# Altium schematic sheet Sheet1.SchDoc
size A4
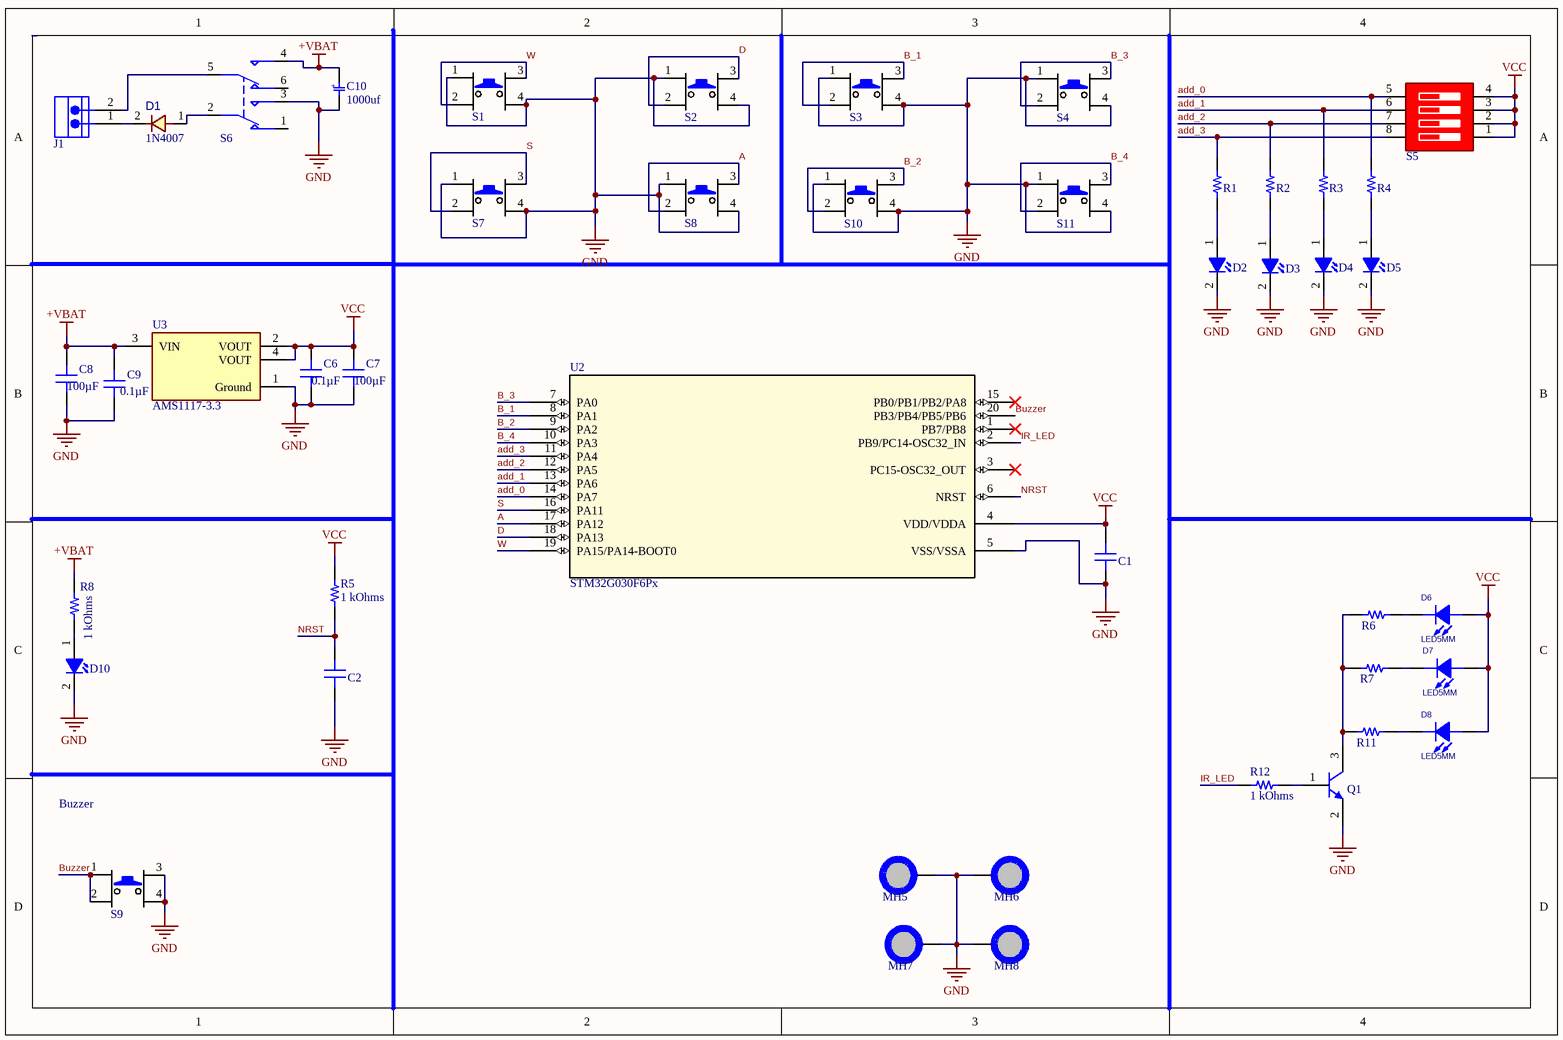
[diagram p0: Sheet1.SchDoc]

## Parts
C1  0.1µF  [CAP 0805_2012]  (value not drawn)
C2  0.1µF  [CAP 0805_2012]  (value not drawn)
C6  0.1µF  [CAP 0805_2012]
C7  100µF  [CAP 0805_2012]
C8  100µF  [CAP 0805_2012]
C9  0.1µF  [CAP 0805_2012]
C10  value 1000uf  [Cap_3_(3.5mm)]  (hidden comment: Capacitor Electrical THD)
D1  value 1N4007  [D_SMA]  (hidden comment: 1N4007 SMD M7)
D2  LED THD 3mm  [LED THD 3mm (White)]  (value not drawn)
D3  LED THD 3mm  [LED THD 3mm (White)]  (value not drawn)
D4  LED THD 3mm  [LED THD 3mm (White)]  (value not drawn)
D5  LED THD 3mm  [LED THD 3mm (White)]  (value not drawn)
D6  LED5MM  [LED THD 5mm (Yellow)]
D7  LED5MM  [LED THD 5mm (Yellow)]
D8  LED5MM  [LED THD 5mm (Yellow)]
D10  LED THD 3mm  [LED THD 3mm (White)]  (value not drawn)
J1  Socket Blue 2  [Socket Blue 2]  (value not drawn)
MH5  MH_7.4mmC_3.2mmD  [MH_7.4mmC_3.2mmD]  (value not drawn)  (no BOM)
MH6  MH_7.4mmC_3.2mmD  [MH_7.4mmC_3.2mmD]  (value not drawn)  (no BOM)
MH7  MH_7.4mmC_3.2mmD  [MH_7.4mmC_3.2mmD]  (value not drawn)  (no BOM)
MH8  MH_7.4mmC_3.2mmD  [MH_7.4mmC_3.2mmD]  (value not drawn)  (no BOM)
Q1  MMBT2222A-7-F  [DIODES SOT-23-3]  (value not drawn)
R1  50 mOhms  [RES 0805_2012]  (value not drawn)
R2  50 mOhms  [RES 0805_2012]  (value not drawn)
R3  50 mOhms  [RES 0805_2012]  (value not drawn)
R4  50 mOhms  [RES 0805_2012]  (value not drawn)
R5  1 kOhms  [RES 0805_2012]
R6  68 Ohms  [RES 0805_2012]  (value not drawn)
R7  68 Ohms  [RES 0805_2012]  (value not drawn)
R8  1 kOhms  [RES 0805_2012]
R11  68 Ohms  [RES 0805_2012]  (value not drawn)
R12  1 kOhms  [RES 0805_2012]
S1  SW_PB4 THD  [SW THD 4 PIN (25) 12X12SKHC]  (value not drawn)
S2  SW_PB4 THD  [SW THD 4 PIN (25) 12X12SKHC]  (value not drawn)
S3  SW_PB4 THD  [SW THD 4 PIN (25) 12X12SKHC]  (value not drawn)
S4  SW_PB4 THD  [SW THD 4 PIN (25) 12X12SKHC]  (value not drawn)
S5  DIP Switch 4  [dip switch 4  Blue THD]  (value not drawn)
S6  Double Switch  [SWPUST_DPDT_S2]  (value not drawn)
S7  SW_PB4 THD  [SW THD 4 PIN (25) 12X12SKHC]  (value not drawn)
S8  SW_PB4 THD  [SW THD 4 PIN (25) 12X12SKHC]  (value not drawn)
S9  SW_PB4 THD  [SW THD 4 PIN (6)]  (value not drawn)
S10  SW_PB4 THD  [SW THD 4 PIN (25) 12X12SKHC]  (value not drawn)
S11  SW_PB4 THD  [SW THD 4 PIN (25) 12X12SKHC]  (value not drawn)
U2  STM32G030F6Px  [TSSOP20]
U3  AMS1117-3.3  [SOT223-4N]

## Nets
+VBAT: C8.2 C9.2 C10.1 R8.2 S6.4 U3.3(VIN)
GND: C1.1 C2.1 C6.1 C7.1 C8.1 C9.1 C10.2 D2.2(CATHODE) D3.2(CATHODE) D4.2(CATHODE) D5.2(CATHODE) D10.2(CATHODE) MH5.0 MH6.0 MH7.0 MH8.0 Q1.2(E) S1.1 S1.4 S2.1 S2.4 S3.1 S3.4 S4.1 S4.4 S6.3 S7.1 S7.4 S8.1 S8.4 S9.3 S9.4 S10.1 S10.4 S11.1 S11.4 U2.5(VSS/VSSA) U3.1(Ground)
VCC: C1.2 C6.2 C7.2 D6.1(ANODE) D7.1(ANODE) D8.1(ANODE) R5.1 S5.1 S5.2 S5.3 S5.4 U2.4(VDD/VDDA) U3.2(VOUT) U3.4(VOUT)
A: S8.2 S8.3 U2.17(PA12)
add_0: R4.2 S5.5 U2.14(PA7)
add_1: R3.2 S5.6 U2.13(PA6)
add_2: R2.2 S5.7 U2.12(PA5)
add_3: R1.2 S5.8 U2.11(PA4)
B_1: S3.2 S3.3 U2.8(PA1)
B_2: S10.2 S10.3 U2.9(PA2)
B_3: S4.2 S4.3 U2.7(PA0)
B_4: S11.2 S11.3 U2.10(PA3)
Buzzer: S9.1 S9.2 U2.20(PB3/PB4/PB5/PB6)
D: S2.2 S2.3 U2.18(PA13)
IR_LED: R12.1 U2.2(PB9/PC14-OSC32_IN)
NRST: C2.2 R5.2 U2.6(NRST)
S: S7.2 S7.3 U2.16(PA11)
W: S1.2 S1.3 U2.19(PA15/PA14-BOOT0)
NetD1_1: D1.1 S6.2
NetD1_2: D1.2 J1.1
NetD2_1: D2.1(ANODE) R1.1
NetD3_1: D3.1(ANODE) R2.1
NetD4_1: D4.1(ANODE) R3.1
NetD5_1: D5.1(ANODE) R4.1
NetD6_2: D6.2(CATHODE) R6.2
NetD7_2: D7.2(CATHODE) R7.2
NetD8_2: D8.2(CATHODE) R11.2
NetD10_1: D10.1(ANODE) R8.1
NetJ1_2: J1.2 S6.5
NetQ1_1: Q1.1(B) R12.2
NetQ1_3: Q1.3(C) R6.1 R7.1 R11.1

Not connected (* = marked no-connect by the designer): S6 1 6; U2 1(PB7/PB8)* 3(PC15-OSC32_OUT)* 15(PB0/PB1/PB2/PA8)*

## Notes on the sheet
- Buzzer
- (in symbol Capacitor Electrical THD) +

## Library data of the parts
C1 C2 C6 C9 = AC0805KKX8R9BB104: CAP CER 0805 10% X8R 50V 100NF; Manufacturer: Yageo; Part Number: AC0805KKX8R9BB104; Applications: Automotive; Capacitance: 0.1µF; ComponentLink1Description: Datasheet; ComponentLink1URL: http://www.yageo.com/documents/recent/AC0805KKX8R9BB104.pdf; ComponentLink2Description: DigiKey Link; ComponentLink2URL: http://digikey.com/product-detail/en/yageo/AC0805KKX8R9BB104/311-4624-1-ND/9699550; Device Package: 0805 (2012 Metric); LastUpdated: 2020-09-02 01:04:19.917000; Lifecycle Status: Active; Minimum Order: 1; Mounting Type: Surface Mount, MLCC; Operating Temperature: -55°C ~ 150°C; Package / Case: 0805 (2012 Metric); Packaging: TapeAndReel; PartId: 14076; Part Status: Active; Price: 0.06; Ratings: AEC-Q200; Series: AC; Size / Dimension: 0.079 L x 0.049 W (2.00mm x 1.25mm); Supplier 1: DigiKey; Supplier Part Number 1: 311-4624-1-ND; Temperature Coefficient: X8R; Thickness (Max): 0.057 (1.45mm); Tolerance: ±10%; Value: 0.1µF; Voltage - Rated: 50V
C7 C8 = GRM21BR60J107ME15L: CAP CER 100UF 6.3V X5R 0805; Manufacturer: Murata Electronics; Tolerance: ±20%; Part Number: GRM21BR60J107ME15L; Applications: General Purpose; Capacitance: 100µF; ComponentLink1Description: Datasheet; ComponentLink1URL: https://search.murata.co.jp/Ceramy/image/img/A01X/G101/ENG/GRM21BR60J107ME15-01.pdf; ComponentLink2Description: DigiKey Link; ComponentLink2URL: http://digikey.com/product-detail/en/murata-electronics/GRM21BR60J107ME15L/490-13981-1-ND/6155811; Device Package: 0805 (2012 Metric); LastUpdated: 2020-09-02 01:04:10.617000; Lifecycle Status: Active; Minimum Order: 1; Mounting Type: Surface Mount, MLCC; Operating Temperature: -55°C ~ 85°C; Package / Case: 0805 (2012 Metric); Packaging: TapeAndReel; PartId: 16995; Part Status: Active; Price: 0.61; Series: GRM; Size / Dimension: 0.079 L x 0.049 W (2.00mm x 1.25mm); Supplier 1: DigiKey; Supplier Part Number 1: 490-13981-1-ND; Temperature Coefficient: X5R; Thickness (Max): 0.057 (1.45mm); Value: 100µF; Voltage - Rated: 6.3V
D1 = 1N4007 SMD M7: DIODE, GENERAL PURPOSE, 1000V/1A; DatasheetVersion: 2021; ComponentLink1Description: Website Smart World; ComponentLink1URL: https://www.smartw.ir/; ComponentLink2Description: Telegram; ComponentLink2URL: https://t.me/altium_smartw; ComponentLink3Description: Instagram; ComponentLink3URL: https://Instagram.com/smartgw.ir
D6-D8 = LED5MM: LED LIGHTING; Designer: Abbas Basereh; Data: 16-12-2016; Link: *; Part.No: *
MH5-MH8 = MH_7.4mmC_3.2mmD: MH_7.4MM Diameter,3.2mm Drill
Q1 = MMBT2222A-7-F: TRANS NPN 40V 0.6A SMD SOT23-3; Manufacturer: Diodes Incorporated; Current - Collector Cutoff (Max): 10nA (ICBO); Current - Collector (Ic) (Max): 600mA; DC Current Gain (hFE) (Min) @ Ic, Vce: 100 @ 150mA, 10V; Frequency - Transition: 300MHz; Power - Max: 310mW; Vce Saturation (Max) @ Ib, Ic: 1V @ 50mA, 500mA; Part Number: MMBT2222A-7-F; ComponentLink1Description: Datasheet; ComponentLink1URL: https://www.diodes.com/assets/Datasheets/ds30041.pdf; ComponentLink2Description: DigiKey Link; ComponentLink2URL: http://digikey.com/product-detail/en/diodes-incorporated/MMBT2222A-7-F/MMBT2222A-FDICT-ND/815723; LastUpdated: 2020-09-02 01:30:06.317000; Lifecycle Status: Active; Minimum Order: 1; Mounting Type: Surface Mount; Operating Temperature: -55°C ~ 150°C (TJ); Package / Case: TO-236-3, SC-59, SOT-23-3; Packaging: TapeAndReel; PartId: 84; Part Status: Active; Price: 0.02; Series: Automotive, AEC-Q101; Supplier 1: DigiKey; Supplier Part Number 1: MMBT2222A-FDICT-ND; Supplier Device Package: SOT-23-3; Transistor Type: NPN; Voltage - Collector Emitter Breakdown (Max): 40V
R1-R4 = CRM0805-FW-R050ELF: RES 0.05 OHM 1% 1/4W 0805; Manufacturer: Bourns Inc.; Power (Watts): 0.25W, 1/4W; Temperature Coefficient: ±200ppm/°C; Part Number: CRM0805-FW-R050ELF; ComponentLink1Description: Datasheet; ComponentLink1URL: https://www.bourns.com/docs/Product-Datasheets/CRM0805_1206_2010.pdf; ComponentLink2Description: DigiKey Link; ComponentLink2URL: http://digikey.com/product-detail/en/bourns-inc/CRM0805-FW-R050ELF/CRM0805-FW-R050ELFCT-ND/3592903; Composition: Thick Film; Device Package: 0805 (2012 Metric); Features: Current Sense; Height - Seated (Max): 0.024 (0.60mm); LastUpdated: 2020-09-02 01:15:22.390000; Lifecycle Status: Active; Minimum Order: 1; Number of Terminations: 2; Operating Temperature: -55°C ~ 155°C; Package / Case: 0805 (2012 Metric); Packaging: TapeAndReel; PartId: 28469; Part Status: Active; Price: 0.14; Resistance: 50 mOhms; Series: CRM0805; Size / Dimension: 0.079 L x 0.047 W (2.00mm x 1.20mm); Supplier 1: DigiKey; Supplier Part Number 1: CRM0805-FW-R050ELFCT-ND; Supplier Device Package: 0805; Tolerance: ±1%; Value: 50 mOhms
R5 R8 R12 = RNCP0805FTD1K00: RES 1K OHM 1% 1/4W 0805; Manufacturer: Stackpole Electronics Inc; Power (Watts): 0.25W, 1/4W; Temperature Coefficient: ±100ppm/°C; Part Number: RNCP0805FTD1K00; ComponentLink1Description: Datasheet; ComponentLink1URL: https://www.seielect.com/catalog/sei-rncp.pdf; ComponentLink2Description: DigiKey Link; ComponentLink2URL: http://digikey.com/product-detail/en/stackpole-electronics-inc/RNCP0805FTD1K00/RNCP0805FTD1K00CT-ND/2240568; Composition: Thin Film; Device Package: 0805 (2012 Metric); Features: Anti-Sulfur, Moisture Resistant; Height - Seated (Max): 0.024 (0.60mm); LastUpdated: 2020-09-02 01:15:23.347000; Lifecycle Status: Active; Minimum Order: 1; Number of Terminations: 2; Operating Temperature: -55°C ~ 155°C; Package / Case: 0805 (2012 Metric); Packaging: TapeAndReel; PartId: 28023; Part Status: Active; Price: 0.01; Resistance: 1 kOhms; Series: RNCP; Size / Dimension: 0.079 L x 0.049 W (2.00mm x 1.25mm); Supplier 1: DigiKey; Supplier Part Number 1: RNCP0805FTD1K00CT-ND; Supplier Device Package: 0805; Tolerance: ±1%; Value: 1 kOhms
R6 R7 R11 = CRGP0805F68R: CRGP 0805 68R 1%; Manufacturer: TE Connectivity Passive Product; Power (Watts): 0.333W, 1/3W; Temperature Coefficient: ±200ppm/°C; Part Number: CRGP0805F68R; ComponentLink1Description: Datasheet; ComponentLink1URL: https://www.te.com/commerce/DocumentDelivery/DDEController?Action=srchrtrv&DocNm=9-1773463-9&DocType=DS&DocLang=English; ComponentLink2Description: DigiKey Link; ComponentLink2URL: http://digikey.com/product-detail/en/te-connectivity-passive-product/CRGP0805F68R/A130463CT-ND/8578295; Composition: Thick Film; Device Package: 0805 (2012 Metric); Features: Pulse Withstanding; Height - Seated (Max): 0.026 (0.65mm); LastUpdated: 2020-09-02 01:15:21.913000; Lifecycle Status: Active; Minimum Order: 1; Number of Terminations: 2; Operating Temperature: -55°C ~ 155°C; Package / Case: 0805 (2012 Metric); Packaging: TapeAndReel; PartId: 28711; Part Status: Active; Price: 0.02; Resistance: 68 Ohms; Series: CRGP; Size / Dimension: 0.079 L x 0.049 W (2.00mm x 1.25mm); Supplier 1: DigiKey; Supplier Part Number 1: A130463CT-ND; Supplier Device Package: 0805; Tolerance: ±1%; Value: 68 Ohms
S5 = DIP Switch 4: 4 BIT DIP Switch; ComponentLink1Description: Website Smart World; ComponentLink1URL: https://www.smartw.ir/; ComponentLink2Description: Telegram; ComponentLink2URL: https://t.me/altium_smartw; ComponentLink3Description: Instagram; ComponentLink3URL: https://Instagram.com/smartgw.ir; DatasheetVersion: 2021
S6 = SW DPDT: DPDT Switch; ComponentLink1Description: Website Smart World; ComponentLink1URL: https://www.smartw.ir/; ComponentLink2Description: Telegram; ComponentLink2URL: https://t.me/altium_smartw; ComponentLink3Description: Instagram; ComponentLink3URL: https://Instagram.com/smartgw.ir; DatasheetVersion: 2021
U2 = STM32G030F6Px: The STM32G030x6/x8 mainstream microcontrollers are based on high-performance Arm® Cortex®-M0+ 32-bit RISC core operating at up to 64 MHz frequency. / 32K Flash and 8K RAM with 20pin TSSOP 6.4x4.4mm package; Manufacturer_Part_Number: stm32g0_tssop20_t1; Vendor: STMicroelectronics; Copyright: Copyright (C) 2018 Accelerated Designs. All rights reserved; RefDes: RefDes; Type: DEV; Value: Value
U3 = CMP-209535-000001-1: LDO Voltage Regulators 1A, 3.3V; Manufacturer: Advanced Monolithic Systems; Dropout Voltage: 1.1V; Output Type: Fixed; Nominal Supply Current: 5mA; Max Power Dissipation: 1.2W; Max Supply Voltage: 15V; Number Of Outputs: 1; Standoff Height: 0.64mm; Max Junction Temp: +125°C; Height: 1.8mm; Package: AMS1117; Device Class L2: Power Management ICs; ComponentLink2Description: Datasheet; ComponentLink2URL: http://www.advanced-monolithic.com/pdf/ds1117.pdf; Category: IC; RoHS: TRUE; Automotive: No; Device Class L1: Integrated Circuits (ICs); Output Current: 1A; Device Class L3: Voltage Regulators - Linear; Temperature: -40°C to +125°C; Output Voltage: 3.3V; Manufacturer Part Number: AMS1117-3.3; Temperature Range Low: -40°C; Octopart: https://octopart.com/ams1117-3.3-advanced+monolithic+systems-25899300; Lead Free: Yes; Ipc Land Pattern Name: SOT229P700X180-4; Temperature Range High: +125°C
C10 = Capacitor Electrical THD: DatasheetVersion: 2021; ComponentLink1Description: Website Smart World; ComponentLink1URL: https://www.smartw.ir/; ComponentLink2Description: Telegram; ComponentLink2URL: https://t.me/altium_smartw; ComponentLink3Description: Instagram; ComponentLink3URL: https://Instagram.com/smartgw.ir
D2-D5 D10 = LED THD 3mm: ComponentLink1Description: Website Smart World; ComponentLink1URL: https://www.smartw.ir/; ComponentLink2Description: Telegram; ComponentLink2URL: https://t.me/altium_smartw; ComponentLink3Description: Instagram; ComponentLink3URL: https://Instagram.com/smartgw.ir; DatasheetVersion: 2021
J1 = Socket Blue 2: ComponentLink1Description: Website Smart World; ComponentLink1URL: https://www.smartw.ir/*; ComponentLink2Description: Telegram; ComponentLink2URL: https://t.me/altium_smartw; ComponentLink3Description: Instagram; ComponentLink3URL: https://Instagram.com/smartgw.ir; DatasheetVersion: 2021
S1-S4 S7-S11 = SW_PB4 THD: ComponentLink1Description: Website Smart World; ComponentLink1URL: https://www.smartw.ir/; ComponentLink2Description: Telegram; ComponentLink2URL: https://t.me/altium_smartw; ComponentLink3Description: Instagram; ComponentLink3URL: https://Instagram.com/smartgw.ir; DatasheetVersion: 2021